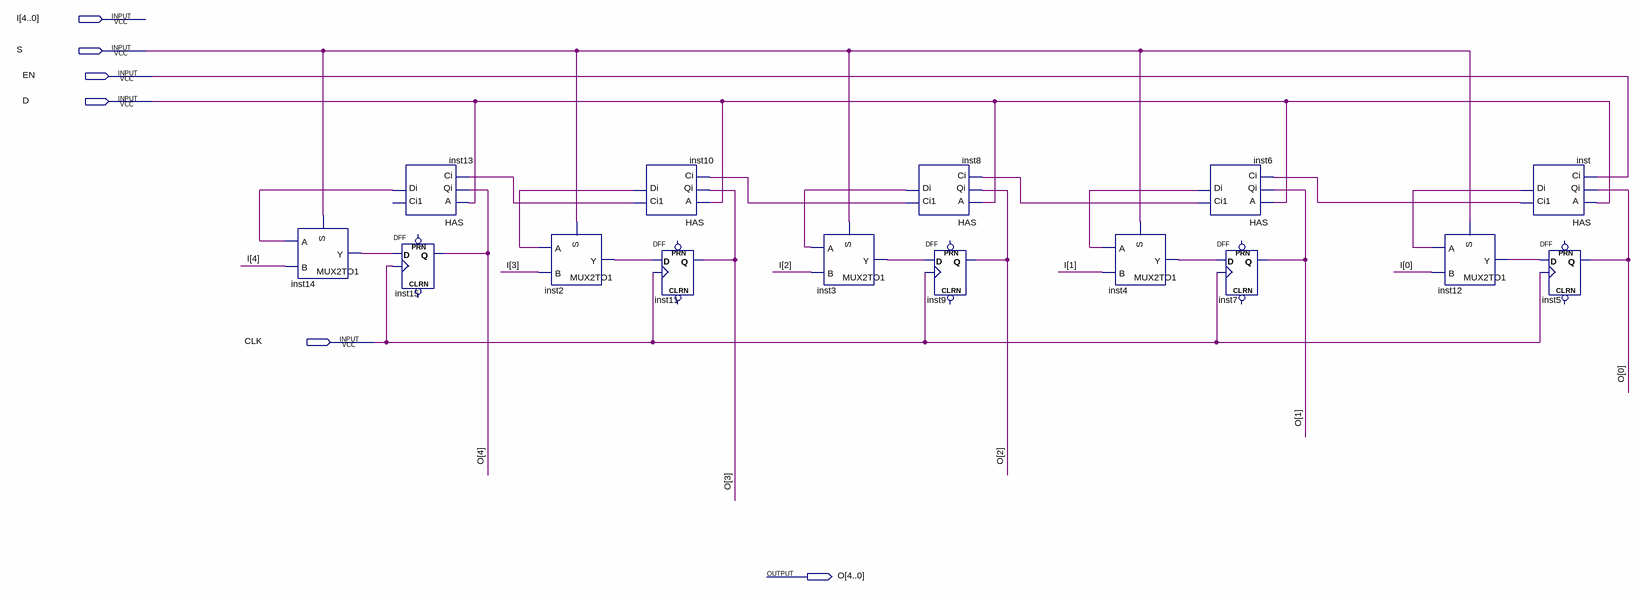
[diagram p0: schematic sheet]
// Quartus schematic COUNTER4BIT.bdf as structural Verilog: 15 symbols, 6 pins
module COUNTER4BIT (
  input  [4:0] I,
  input  S,
  input  EN,
  input  D,
  input  CLK,
  output [4:0] O
);

  wire inst2_y, inst3_y, inst4_y, inst6_ci1, inst6_di, inst8_ci1, inst8_di, inst10_ci1, inst10_di, inst12_y,
       inst13_di, inst14_y, inst_ci1, inst_di;

  MUX2TO1 inst14 (.S(S), .A(inst13_di), .B(I[4]), .Y(inst14_y));
  HAS inst13 (.A(D), .Qi(O[4]), .Ci(inst10_ci1), .Di(inst13_di));  // open: Ci1
  DFF inst15 (.CLK(CLK), .D(inst14_y), .Q(O[4]));  // open: CLRN, PRN
  MUX2TO1 inst2 (.S(S), .A(inst10_di), .B(I[3]), .Y(inst2_y));
  HAS inst10 (.A(D), .Qi(O[3]), .Ci(inst8_ci1), .Ci1(inst10_ci1), .Di(inst10_di));
  DFF inst11 (.CLK(CLK), .D(inst2_y), .Q(O[3]));  // open: CLRN, PRN
  MUX2TO1 inst3 (.S(S), .A(inst8_di), .B(I[2]), .Y(inst3_y));
  HAS inst8 (.A(D), .Qi(O[2]), .Ci(inst6_ci1), .Ci1(inst8_ci1), .Di(inst8_di));
  DFF inst9 (.CLK(CLK), .D(inst3_y), .Q(O[2]));  // open: CLRN, PRN
  MUX2TO1 inst4 (.S(S), .A(inst6_di), .B(I[1]), .Y(inst4_y));
  HAS inst6 (.A(D), .Qi(O[1]), .Ci(inst_ci1), .Ci1(inst6_ci1), .Di(inst6_di));
  DFF inst7 (.CLK(CLK), .D(inst4_y), .Q(O[1]));  // open: CLRN, PRN
  MUX2TO1 inst12 (.S(S), .A(inst_di), .B(I[0]), .Y(inst12_y));
  HAS inst (.A(D), .Qi(O[0]), .Ci(EN), .Ci1(inst_ci1), .Di(inst_di));
  DFF inst5 (.CLK(CLK), .D(inst12_y), .Q(O[0]));  // open: CLRN, PRN
endmodule
